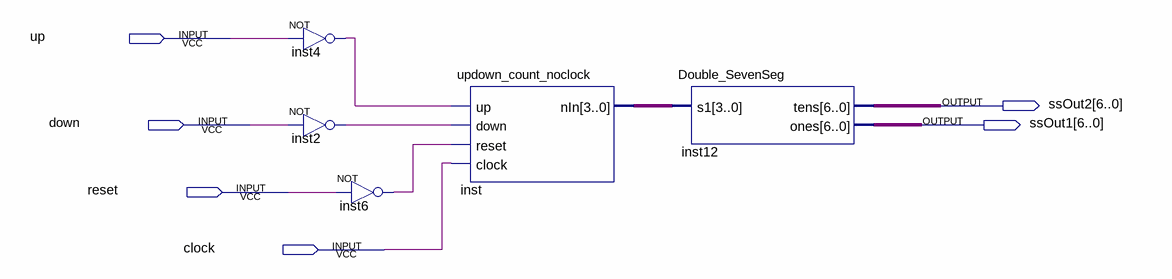
[diagram p0: schematic sheet]
// Quartus schematic BlockNoclock.bdf as structural Verilog: 5 symbols, 6 pins
module BlockNoclock (
  input  up,
  input  down,
  input  reset,
  input  clock,
  output [6:0] ssOut2,
  output [6:0] ssOut1
);

  wire inst2_out, inst4_out, inst6_out;
  wire [3:0] inst_nin;

  not inst4 (inst4_out, up);
  not inst2 (inst2_out, down);
  not inst6 (inst6_out, reset);
  updown_count_noclock inst (.up(inst4_out), .down(inst2_out), .reset(inst6_out), .clock(clock), .nIn(inst_nin));
  Double_SevenSeg inst12 (.s1(inst_nin), .tens(ssOut2), .ones(ssOut1));
endmodule
